# Altium project speeduinoAdapter.PrjPcb
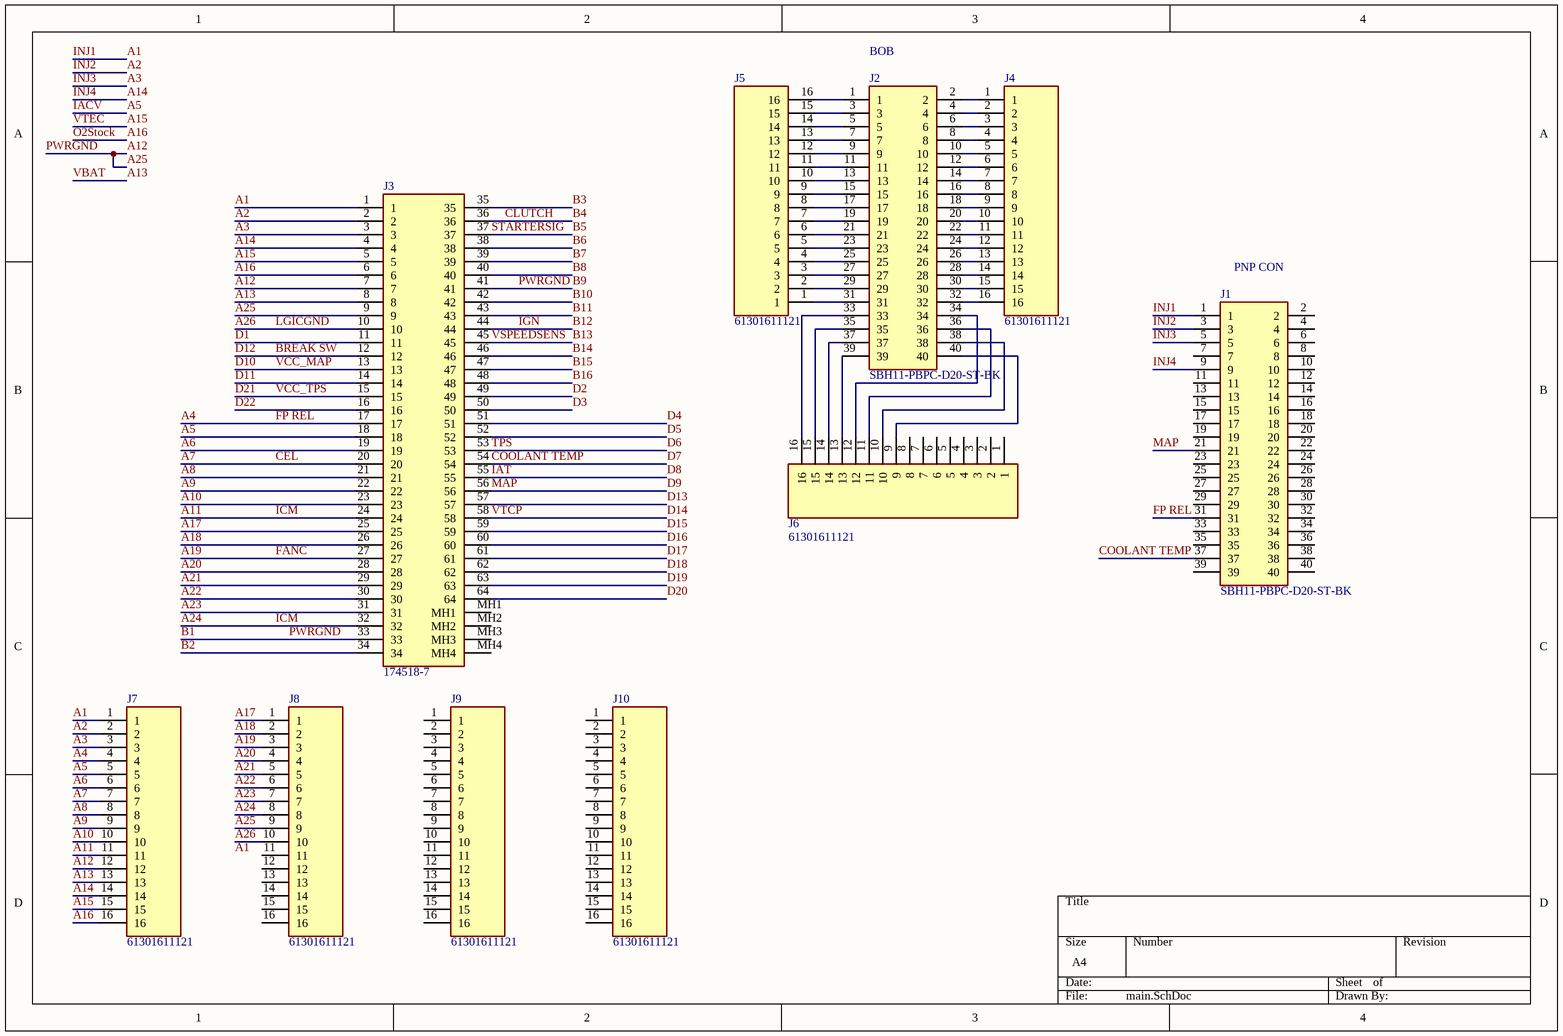
[diagram p0: main.SchDoc]
1 sheet, 10 parts. Net scope: global (net labels, ports and power ports of the same name join across sheets).
Board files: main.PcbDoc, PCB2.PcbDoc

## Sheet main.SchDoc
size A4; SheetNumber: 1; SheetTotal: 1

### Parts
J1  SBH11-PBPC-D20-ST-BK  [SHDR40W64P254_2X20_5830X910X910P]
J2  SBH11-PBPC-D20-ST-BK  [SHDR40W64P254_2X20_5830X910X910P]
J3  174518-7  [1745187]
J4  61301611121  [HDRV16W79P0X254_1X16_4064X254X874P]
J5  61301611121  [HDRV16W79P0X254_1X16_4064X254X874P]
J6  61301611121  [HDRV16W79P0X254_1X16_4064X254X874P]
J7  61301611121  [HDRV16W79P0X254_1X16_4064X254X874P]
J8  61301611121  [HDRV16W79P0X254_1X16_4064X254X874P]
J9  61301611121  [HDRV16W79P0X254_1X16_4064X254X874P]
J10  61301611121  [HDRV16W79P0X254_1X16_4064X254X874P]

### Nets
A1: J1.1 J3.1 J7.1  [also labelled INJ1]
A2: J1.3 J3.2 J7.2  [also labelled INJ2]
A3: J1.5 J3.3 J7.3  [also labelled INJ3]
A4: J1.31 J3.17 J7.4  [also labelled FP REL]
A5: J3.18 J7.5  [also labelled IACV]
A6: J3.19 J7.6
A7: J3.20 J7.7  [also labelled CEL]
A8: J3.21 J7.8
A9: J3.22 J7.9
A10: J3.23 J7.10
A11: J3.24 J3.32 J7.11 J8.8  [also labelled A24, ICM]
A12: J3.7 J3.9 J3.33 J3.41 J7.12 J8.9  [also labelled A25, B1, B9, PWRGND]
A13: J3.8 J7.13  [also labelled VBAT]
A14: J1.9 J3.4 J7.14  [also labelled INJ4]
A15: J3.5 J7.15  [also labelled VTEC]
A16: J3.6 J7.16  [also labelled O2Stock]
A17: J3.25 J8.1
A18: J3.26 J8.2
A19: J3.27 J8.3  [also labelled FANC]
A20: J3.28 J8.4
A21: J3.29 J8.5
A22: J3.30 J8.6
A23: J3.31 J8.7
A26: J3.10 J8.10  [also labelled LGICGND]
B2: J3.34
B3: J3.35
B4: J3.36  [also labelled CLUTCH]
B5: J3.37  [also labelled STARTERSIG]
B6: J3.38
B7: J3.39
B8: J3.40
B10: J3.42
B11: J3.43
B12: J3.44  [also labelled IGN]
B13: J3.45  [also labelled VSPEEDSENS]
B14: J3.46
B15: J3.47
B16: J3.48
BREAK SW: J3.12  [also labelled D12]
COOLANT TEMP: J1.37 J3.54  [also labelled D7]
D1: J3.11
D2: J3.49
D3: J3.50
D4: J3.51
D5: J3.52
D6: J3.53  [also labelled TPS]
D8: J3.55  [also labelled IAT]
D9: J1.21 J3.56  [also labelled MAP]
D10: J3.13  [also labelled VCC_MAP]
D11: J3.14
D13: J3.57
D14: J3.58  [also labelled VTCP]
D15: J3.59
D16: J3.60
D17: J3.61
D18: J3.62
D19: J3.63
D20: J3.64
D21: J3.15  [also labelled VCC_TPS]
D22: J3.16
NetJ2_1: J2.1 J5.16
NetJ2_2: J2.2 J4.1
NetJ2_3: J2.3 J5.15
NetJ2_4: J2.4 J4.2
NetJ2_5: J2.5 J5.14
NetJ2_6: J2.6 J4.3
NetJ2_7: J2.7 J5.13
NetJ2_8: J2.8 J4.4
NetJ2_9: J2.9 J5.12
NetJ2_10: J2.10 J4.5
NetJ2_11: J2.11 J5.11
NetJ2_12: J2.12 J4.6
NetJ2_13: J2.13 J5.10
NetJ2_14: J2.14 J4.7
NetJ2_15: J2.15 J5.9
NetJ2_16: J2.16 J4.8
NetJ2_17: J2.17 J5.8
NetJ2_18: J2.18 J4.9
NetJ2_19: J2.19 J5.7
NetJ2_20: J2.20 J4.10
NetJ2_21: J2.21 J5.6
NetJ2_22: J2.22 J4.11
NetJ2_23: J2.23 J5.5
NetJ2_24: J2.24 J4.12
NetJ2_25: J2.25 J5.4
NetJ2_26: J2.26 J4.13
NetJ2_27: J2.27 J5.3
NetJ2_28: J2.28 J4.14
NetJ2_29: J2.29 J5.2
NetJ2_30: J2.30 J4.15
NetJ2_31: J2.31 J5.1
NetJ2_32: J2.32 J4.16
NetJ2_33: J2.33 J6.16
NetJ2_34: J2.34 J6.12
NetJ2_35: J2.35 J6.15
NetJ2_36: J2.36 J6.11
NetJ2_37: J2.37 J6.14
NetJ2_38: J2.38 J6.10
NetJ2_39: J2.39 J6.13
NetJ2_40: J2.40 J6.9

Not connected (* = marked no-connect by the designer): J1 2 4 6 7 8 10 11 12 13 14 15 16 17 18 19 20 22 23 24 25 26 27 28 29 30 32 33 34 35 36 38 39 40; J3 MH1 MH2 MH3 MH4; J6 1 2 3 4 5 6 7 8; J8 11 12 13 14 15 16; J9 1 2 3 4 5 6 7 8 9 10 11 12 13 14 15 16; J10 1 2 3 4 5 6 7 8 9 10 11 12 13 14 15 16

### Notes on the sheet
- (near J2) BOB
- (near J1) PNP CON
- Labels drawn without touching a wire or pin: A1

### Library data of the parts
J1 J2 = SBH11-PBPC-D20-ST-BK: Connector; Manufacturer_Name: Sullins; Datasheet Link: https://drawings-pdf.s3.amazonaws.com/11091.pdf; Height: 9.1mm; Manufacturer_Part_Number: SBH11-PBPC-D20-ST-BK
J3 = 174518-7: Connector; Manufacturer_Name: TE Connectivity; Datasheet Link: https://www.arrow.com/en/products/174518-7/te-connectivity; Height: 21.9mm; Manufacturer_Part_Number: 174518-7; Mouser Part Number: 571-174518-7; Mouser Price/Stock: https://www.mouser.co.uk/ProductDetail/TE-Connectivity-AMP/174518-7?qs=13zqzmHBAMHCi5ru1NMUcA%3D%3D; Arrow Part Number: 174518-7; Arrow Price/Stock: https://www.arrow.com/en/products/174518-7/te-connectivity
J4-J10 = 61301611121: Connector; Manufacturer_Name: Wurth Elektronik; Datasheet Link: https://www.we-online.com/catalog/datasheet/61301611121.pdf; Height: 8.74mm; Manufacturer_Part_Number: 61301611121; Mouser Part Number: 710-61301611121; Mouser Price/Stock: https://www.mouser.co.uk/ProductDetail/Wurth-Elektronik/61301611121?qs=PhR8RmCirEYq%2F9PEO1%2F%252B%252Bg%3D%3D